# EAGLE design RFID_board_v211 (EAGLE 5.10)
DIGIKEY: Z1012-ND; MOUSER: 651-1935174
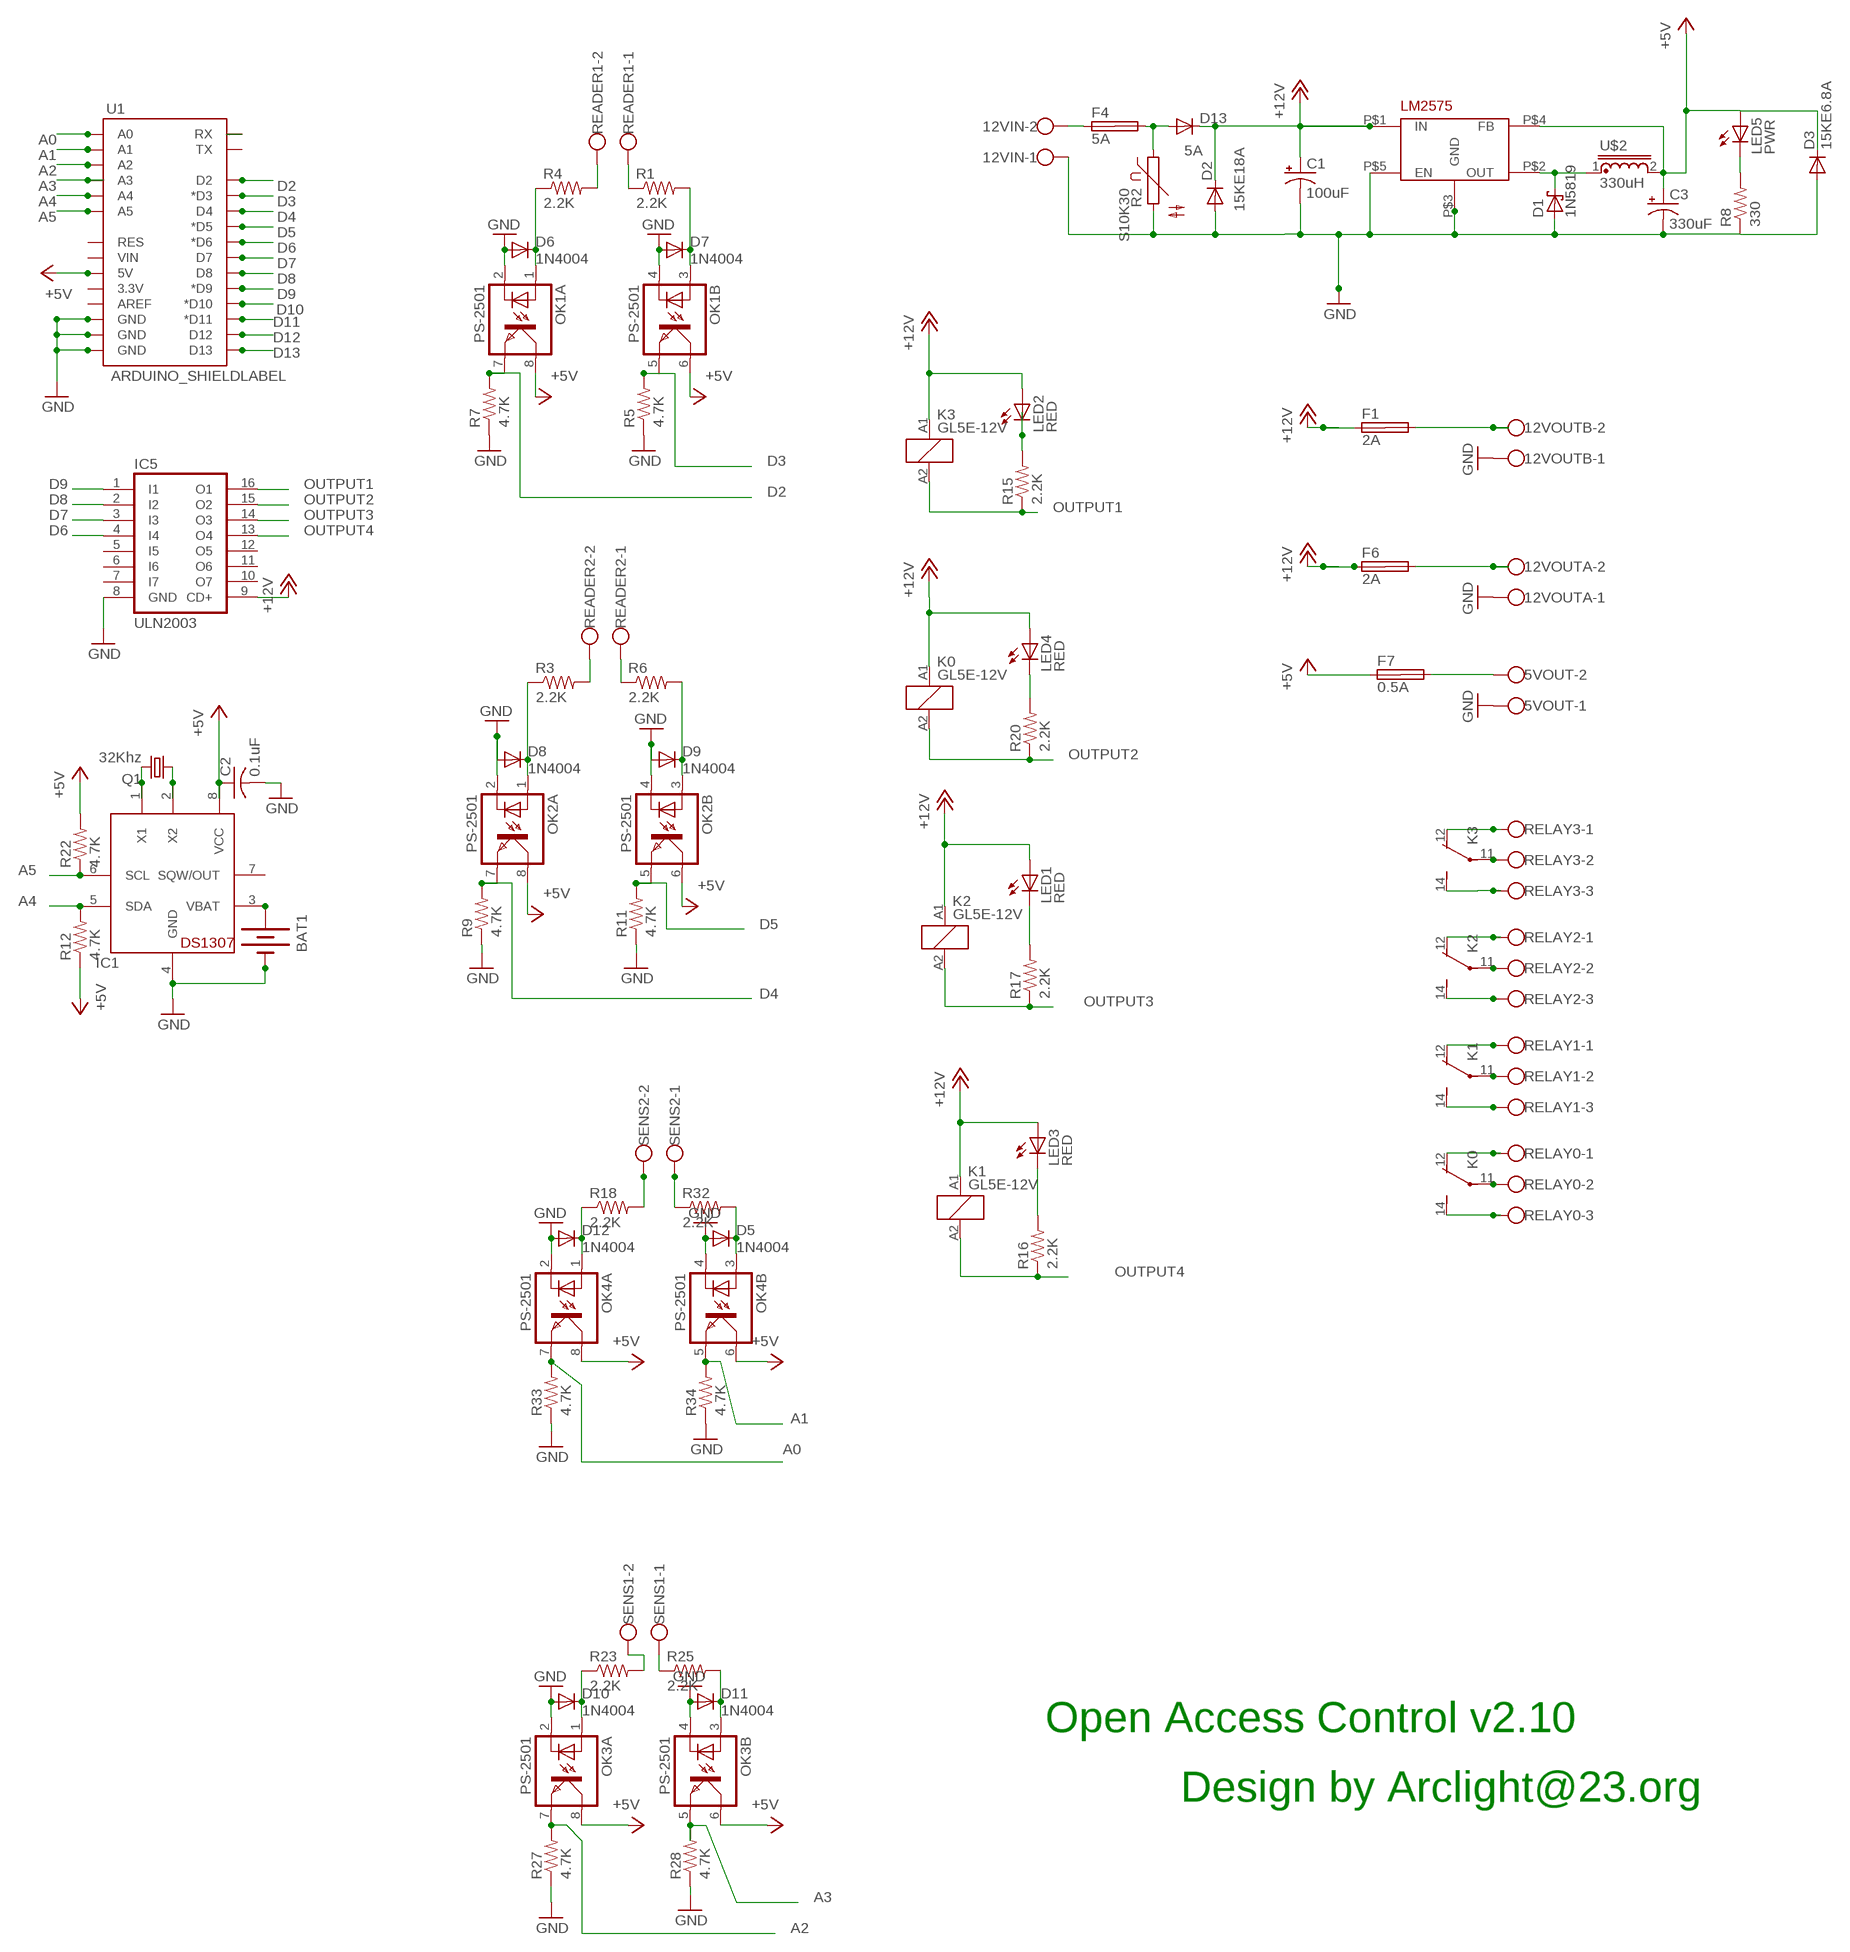
[diagram p0: schematic, sheet 1]

## Parts
5VOUT  W237-102  [W237-102]
12VIN  W237-102  [W237-102]
12VOUTA  W237-102  [W237-102]
12VOUTB  W237-102  [W237-102]
BAT1  BATTERY20PTH  [BATTCOM_20MM_PTH]
C1  100uF  CPOL-USE3.5-8  [E3,5-8]
C2  0.1uF  C-US050-025X075  [C050-025X075]
C3  330uF  CPOL-USE3.5-8  [E3,5-8]
D1  1N5819  1N5819-B  [DO41-7.6]
D2  15KE18A  [DO201-15]
D3  15KE6.8A  15KE18A  [DO201-15]
D5  1N4004  [DO41-10]
D6  1N4004  [DO41-10]
D7  1N4004  [DO41-10]
D8  1N4004  [DO41-10]
D9  1N4004  [DO41-10]
D10  1N4004  [DO41-10]
D11  1N4004  [DO41-10]
D12  1N4004  [DO41-10]
D13  5A  DIODE-P6-15  [P6-15]
F1  2A  5X20MMCLIP  [SHK20Q]
F4  5A  5X20MMCLIP  [SHK20Q]
F6  2A  5X20MMCLIP  [SHK20Q]
F7  0.5A  5X20MMCLIP  [SHK20Q]
IC1  DS1307  [DIL08]
IC5  ULN2003  ULN2003AN  [DIL16]
K0  GL5E-12V  ZNS5106  [ZN5]
K1  GL5E-12V  ZNS5106  [ZN5]
K2  GL5E-12V  ZNS5106  [ZN5]
K3  GL5E-12V  ZNS5106  [ZN5]
LED1  RED  LED5MM  [LED5MM]
LED2  RED  LED5MM  [LED5MM]
LED3  RED  LED5MM  [LED5MM]
LED4  RED  LED5MM  [LED5MM]
LED5  PWR  LED5MM  [LED5MM]
OK1  PS-2501  PS2501  [DIL08]
OK2  PS-2501  PS2501  [DIL08]
OK3  PS-2501  PS2501  [DIL08]
OK4  PS-2501  PS2501  [DIL08]
Q1  32Khz  CRYSTALTC26H  [TC26H]
R1  2.2K  R-US_0207/10  [0207/10]
R2  S10K30  [S10K]
R3  2.2K  R-US_0207/10  [0207/10]
R4  2.2K  R-US_0207/10  [0207/10]
R5  4.7K  R-US_0207/10  [0207/10]
R6  2.2K  R-US_0207/10  [0207/10]
R7  4.7K  R-US_0207/10  [0207/10]
R8  330  R-US_0207/10  [0207/10]
R9  4.7K  R-US_0207/10  [0207/10]
R11  4.7K  R-US_0207/10  [0207/10]
R12  4.7K  R-US_0207/10  [0207/10]
R15  2.2K  R-US_0207/10  [0207/10]
R16  2.2K  R-US_0207/10  [0207/10]
R17  2.2K  R-US_0207/10  [0207/10]
R18  2.2K  R-US_0207/10  [0207/10]
R20  2.2K  R-US_0207/10  [0207/10]
R22  4.7K  R-US_0207/10  [0207/10]
R23  2.2K  R-US_0207/10  [0207/10]
R25  2.2K  R-US_0207/10  [0207/10]
R27  4.7K  R-US_0207/10  [0207/10]
R28  4.7K  R-US_0207/10  [0207/10]
R32  2.2K  R-US_0207/10  [0207/10]
R33  4.7K  R-US_0207/10  [0207/10]
R34  4.7K  R-US_0207/10  [0207/10]
READER1  W237-102  [W237-102]
READER2  W237-102  [W237-102]
RELAY0  W237-103  [W237-103]
RELAY1  W237-103  [W237-103]
RELAY2  W237-103  [W237-103]
RELAY3  W237-103  [W237-103]
SENS1  W237-102  [W237-102]
SENS2  W237-102  [W237-102]
U1  ARDUINO_SHIELDLABEL  [DUEMILANOVE_SHIELD]
U$1  LM2575  [TO220-5PIN-1]
U$2  330uH  PE-52647NLPE-52647NL  [PE-52647-NL]

## Nets
+5V [signal]: C2.1 C3.+ D3.C F7.1A IC1.8(VCC) LED5.A OK1.6(B:COL) OK1.8(A:COL) OK2.6(B:COL) OK2.8(A:COL) OK3.6(B:COL) OK3.8(A:COL) OK4.6(B:COL) OK4.8(A:COL) R12.1 R22.2 U1.5V U$1.P$4(FB) U$2.2
+12V [signal]: C1.+ D2.C D13.C F1.1A F6.1A IC5.9(CD+) K0.A1 K1.A1 K2.A1 K3.A1 LED1.A LED2.A LED3.A LED4.A U$1.P$1(IN)
A0 [signal]: OK4.7(A:EMIT) R33.2 U1.A0
A1 [signal]: OK4.5(B:EMIT) R34.2 U1.A1
A2 [signal]: OK3.7(A:EMIT) R27.2 U1.A2
A3 [signal]: OK3.5(B:EMIT) R28.2 U1.A3
A4 [signal]: IC1.5(SDA) R12.2 U1.A4
A5 [signal]: IC1.6(SCL) R22.1 U1.A5
D1 [signal]: U1.RX
D2 [signal]: OK1.7(A:EMIT) R7.2 U1.D2
D3 [signal]: OK1.5(B:EMIT) R5.2 U1.D3(*D3)
D4 [power]: OK2.7(A:EMIT) R9.2 U1.D4
D5 [signal]: OK2.5(B:EMIT) R11.2 U1.D5(*D5)
D6 [signal]: IC5.4(I4) U1.D6(*D6)
D7 [signal]: IC5.3(I3) U1.D7
D8 [signal]: IC5.2(I2) U1.D8
D9 [signal]: IC5.1(I1) U1.D9(*D9)
D10 [signal]: U1.D10(*D10)
D11: U1.D11(*D11)
D12 [signal]: U1.D12
D13 [signal]: U1.D13
F3 [power]: 5VOUT.2 F7.2A
GND [ground]: 5VOUT.1 12VIN.1 12VOUTA.1 12VOUTB.1 BAT1.2(-) C1.- C2.2 C3.- D1.A D2.A D3.A D5.A D6.A D7.A D8.A D9.A D10.A D11.A D12.A IC1.4(GND) IC5.8(GND) OK1.2(A:C) OK1.4(B:C) OK2.2(A:C) OK2.4(B:C) OK3.2(A:C) OK3.4(B:C) OK4.2(A:C) OK4.4(B:C) R2.2 R5.1 R7.1 R8.1 R9.1 R11.1 R27.1 R28.1 R33.1 R34.1 U1.GND@0(GND) U1.GND@1(GND) U1.GND@2(GND) U$1.P$3(GND) U$1.P$5(EN)
N12V07: 12VOUTA.2 F6.2A
N12V99: 12VOUTB.2 F1.2A
N$1 [signal]: D6.C OK1.1(A:A) R4.1
N$2 [signal]: R18.2 SENS2.2
N$3 [signal]: R25.1 SENS1.1
N$4: K1.11(2:P) RELAY1.2
N$5 [signal]: D7.C OK1.3(B:A) R1.2
N$6 [signal]: D8.C OK2.1(A:A) R3.1
N$7: 12VIN.2 F4.1A
N$8 [signal]: D9.C OK2.3(B:A) R6.2
N$9: D13.A F4.2A R2.1
N$10 [power]: D1.C U$1.P$2(OUT) U$2.1
N$11 [signal]: R32.1 SENS2.1
N$12 [signal]: R6.1 READER2.1
N$13 [signal]: LED2.K(C) R15.2
N$14 [signal]: LED5.K(C) R8.2
N$15 [signal]: K2.14(2:S) RELAY2.3
N$16 [signal]: R3.2 READER2.2
N$17 [signal]: IC1.2(X2) Q1.1
N$18 [signal]: IC1.1(X1) Q1.2
N$19 [signal]: BAT1.1(+) IC1.3(VBAT)
N$20 [signal]: D10.C OK3.1(A:A) R23.1
N$21 [signal]: K3.12(2:O) RELAY3.1
N$22 [signal]: K3.14(2:S) RELAY3.3
N$23 [signal]: K1.12(2:O) RELAY1.1
N$24 [signal]: K1.14(2:S) RELAY1.3
N$25 [signal]: K0.12(2:O) RELAY0.1
N$26 [signal]: K0.14(2:S) RELAY0.3
N$27 [signal]: K2.12(2:O) RELAY2.1
N$28 [signal]: LED1.K(C) R17.2
N$29 [signal]: R1.1 READER1.1
N$30 [signal]: LED3.K(C) R16.2
N$33: K3.11(2:P) RELAY3.2
N$35 [signal]: LED4.K(C) R20.2
N$42 [signal]: D11.C OK3.3(B:A) R25.2
N$44 [signal]: D12.C OK4.1(A:A) R18.1
N$45: K2.11(2:P) RELAY2.2
N$47 [signal]: D5.C OK4.3(B:A) R32.2
N$51 [signal]: R4.2 READER1.2
N$55 [signal]: R23.2 SENS1.2
N$57: K0.11(2:P) RELAY0.2
OUTPUT1 [signal]: IC5.16(O1) K3.A2 R15.1
OUTPUT2 [signal]: IC5.15(O2) K0.A2 R20.1
OUTPUT3 [power]: IC5.14(O3) K2.A2 R17.1
OUTPUT4 [signal]: IC5.13(O4) K1.A2 R16.1
Unconnected: F1.1B F1.2B F4.1B F4.2B F6.1B F6.2B F7.1B F7.2B IC1.7(SQW/OUT) IC5.5(I5) IC5.6(I6) IC5.7(I7) IC5.10(O7) IC5.11(O6) IC5.12(O5) U1.3.3V U1.AREF U1.RES U1.TX U1.VIN

## Notes on the sheet
- Open Access Control v2.10
- Design by Arclight@23.org

## Library data of the parts
5VOUT 12VIN 12VOUTA 12VOUTB READER1 READER2 SENS1 SENS2 = 23B_Shop_Library:W237-102: WAGO SCREW CLAMP
BAT1 = SparkFun:BATTERY: Battery Holders Various common sizes : AA, AAA, 20mm coin cell and 12mm coin cell.
C1 C3 = adafruit:CPOL-US: POLARIZED CAPACITOR, American symbol
C2 = adafruit:C-US: CAPACITOR, American symbol
D1 = diode:1N581*: 1.0A SCHOTTKY BARRIER RECTIFIER Source: http://www.diodes.com/datasheets/ds23001.pdf
D2 D3 = 23B_Shop_Library:15KE18A: TVS Diode 15V TVS Protection Diode
D5-D12 = diode:1N4004: DIODE general purpose rectifier, 1 A
D13 = diode:DIODE-: DIODE
F1 F4 F6 F7 = 23B_Shop_Library:5X20MMCLIP: FUSE HOLDER Littelfuse 01110506H 5x20mm clips. Mouser part #576-01110506H
IC1 = 23B_Shop_Library:DS1307: DS1307 Real time clock (RTC) with battery backup ability. Talk to it via i2c
IC5 = 23B_Shop_Library:ULN2003A: DRIVER ARRAY
K0 K1-K3 = relay:ZNS5*: Miniature Power PCB Relay SCHRACK 1pole 10 A Source: http://www.schrack.com/.. 5847.pdf
LED1-LED5 = adafruit:LED: LED OSRAM: - CHIPLED LG R971, LG N971, LY N971, LG Q971, LY Q971, LO R971, LY R971 LH N974, LH R974 LS Q976, LO Q976, LY Q976 LO Q996 - Hyper CHIPLED LW Q18S LB Q993, LB Q99A, LB R99A - SideLED LS A670, LO A670, LY A670, LG A670, LP A670 LB A673, LV A673, LT A673, LW A673 LH A674 LY A675 LS A676, LA A676, LO A676, LY A676, LW A676 LS A679, LY A679, LG A679 - Hyper Micro SIDELED® LS Y876, LA Y876, LO Y876, LY Y876 LT Y87S - SmartLED LW L88C, LW L88S LB L89C, LB L89S, LG L890 LS L89K, LO L89K, LY L89K LS L896, LA L896, LO L896, LY L896 - TOPLED LS T670, LO T670, LY T670, LG T670, LP T670 LSG T670, LSP T670, LSY T670, LOP T670, LYG T670 LG T671, LOG T671, LSG T671 LB T673, LV T673, LT T673, LW T673 LH T674 LS T676, LA T676, LO T676, LY T676, LB T676, LH T676, LSB T676, LW T676 LB T67C, LV T67C, LT T67C, LS T67K, LO T67K, LY T67K, LW E67C LS E67B, LA E67B, LO E67B, LY E67B, LB E67C, LV E67C, LT E67C LW T67C LS T679, LY T679, LG T679 LS T770, LO T770, LY T770, LG T770, LP T770 LB T773, LV T773, LT T773, LW T773 LH T774 LS E675, LA E675, LY E675, LS T675 LS T776, LA T776, LO T776, LY T776, LB T776 LHGB T686 LT T68C, LB T68C - Hyper Mini TOPLED® LB M676 - Mini TOPLED Santana® LG M470 LS M47K, LO M47K, LY M47K Source: http://www.osram.convergy.de/
OK1-OK4 = 23B_Shop_Library:PS2501: NEC PS OPTO COUPLER
Q1 = crystal:CRYSTAL: CRYSTAL
R1 R3-R9 R11 R12 R15-R18 R20 R22 R23 R25 R27 R28 R32-R34 = resistor:R-US_: RESISTOR, American symbol
R2 = 23B_Shop_Library:S10K30: VARISTOR - 30V, 10mm package
RELAY0 RELAY1-RELAY3 = 23B_Shop_Library:W237-103: WAGO SCREW CLAMP
U1 = SparkFun:ARDUINO_SHIELD
U$1 = 23B_Shop_Library:LM2575: Fixed 5V Simple Switcher from National, staggered pins
U$2 = 23B_Shop_Library:PE-52647NL: 330uH, 1A Inductor from Pulse Engineering. Used with National Semiconductor Simple Switcher.

## Net classes
0 5APower: width 2.921 mm, clearance 0.406 mm
1 power: width 0.61 mm, clearance 0.406 mm
2 signal: width 0.406 mm, clearance 0.305 mm
3 ground: width 0.406 mm, drill 0.127 mm, clearance 0.254 mm to class 0, clearance 0.254 mm to class 1, clearance 0.254 mm to class 2

## Board
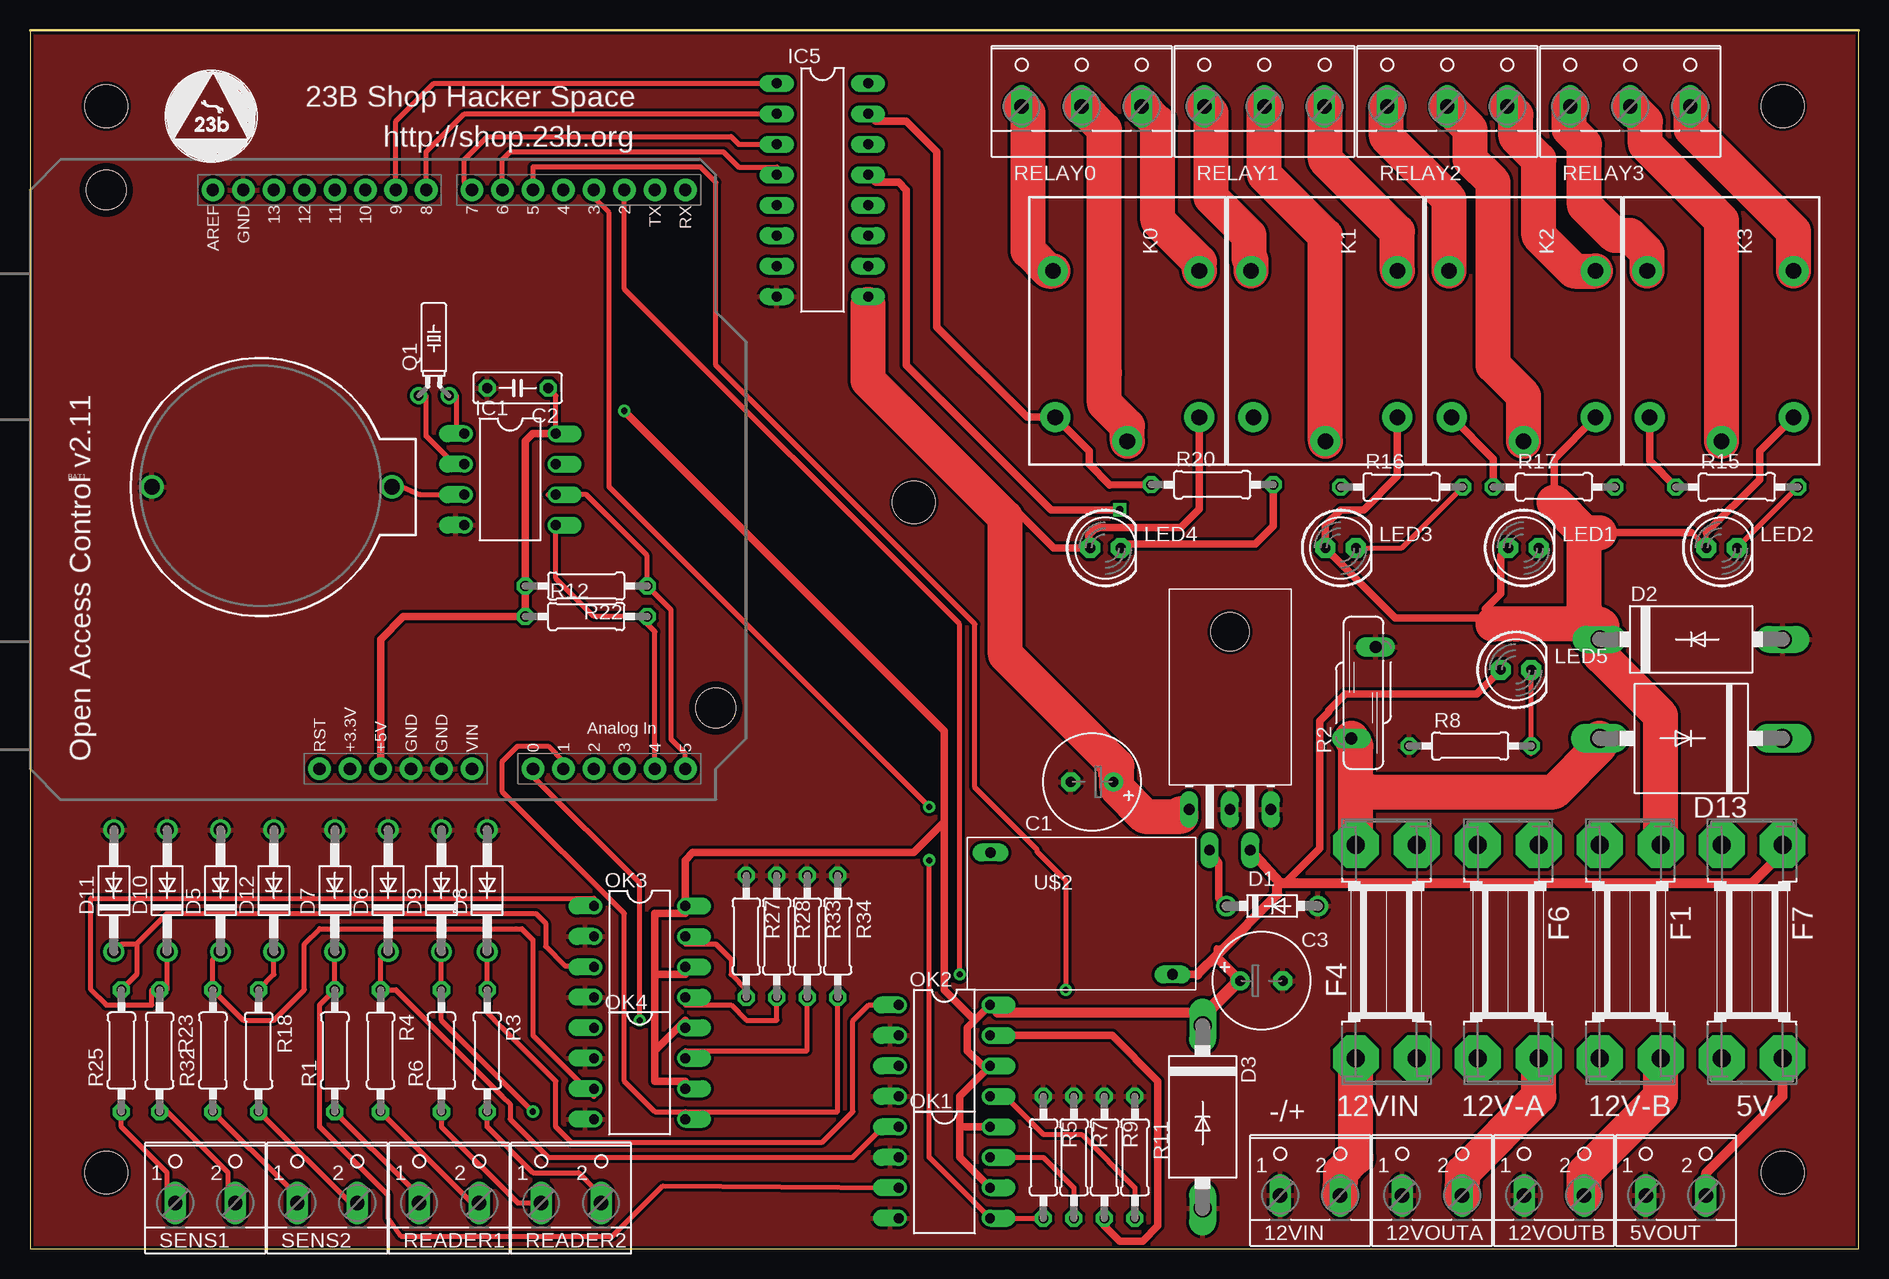
[diagram p1: board, top side]
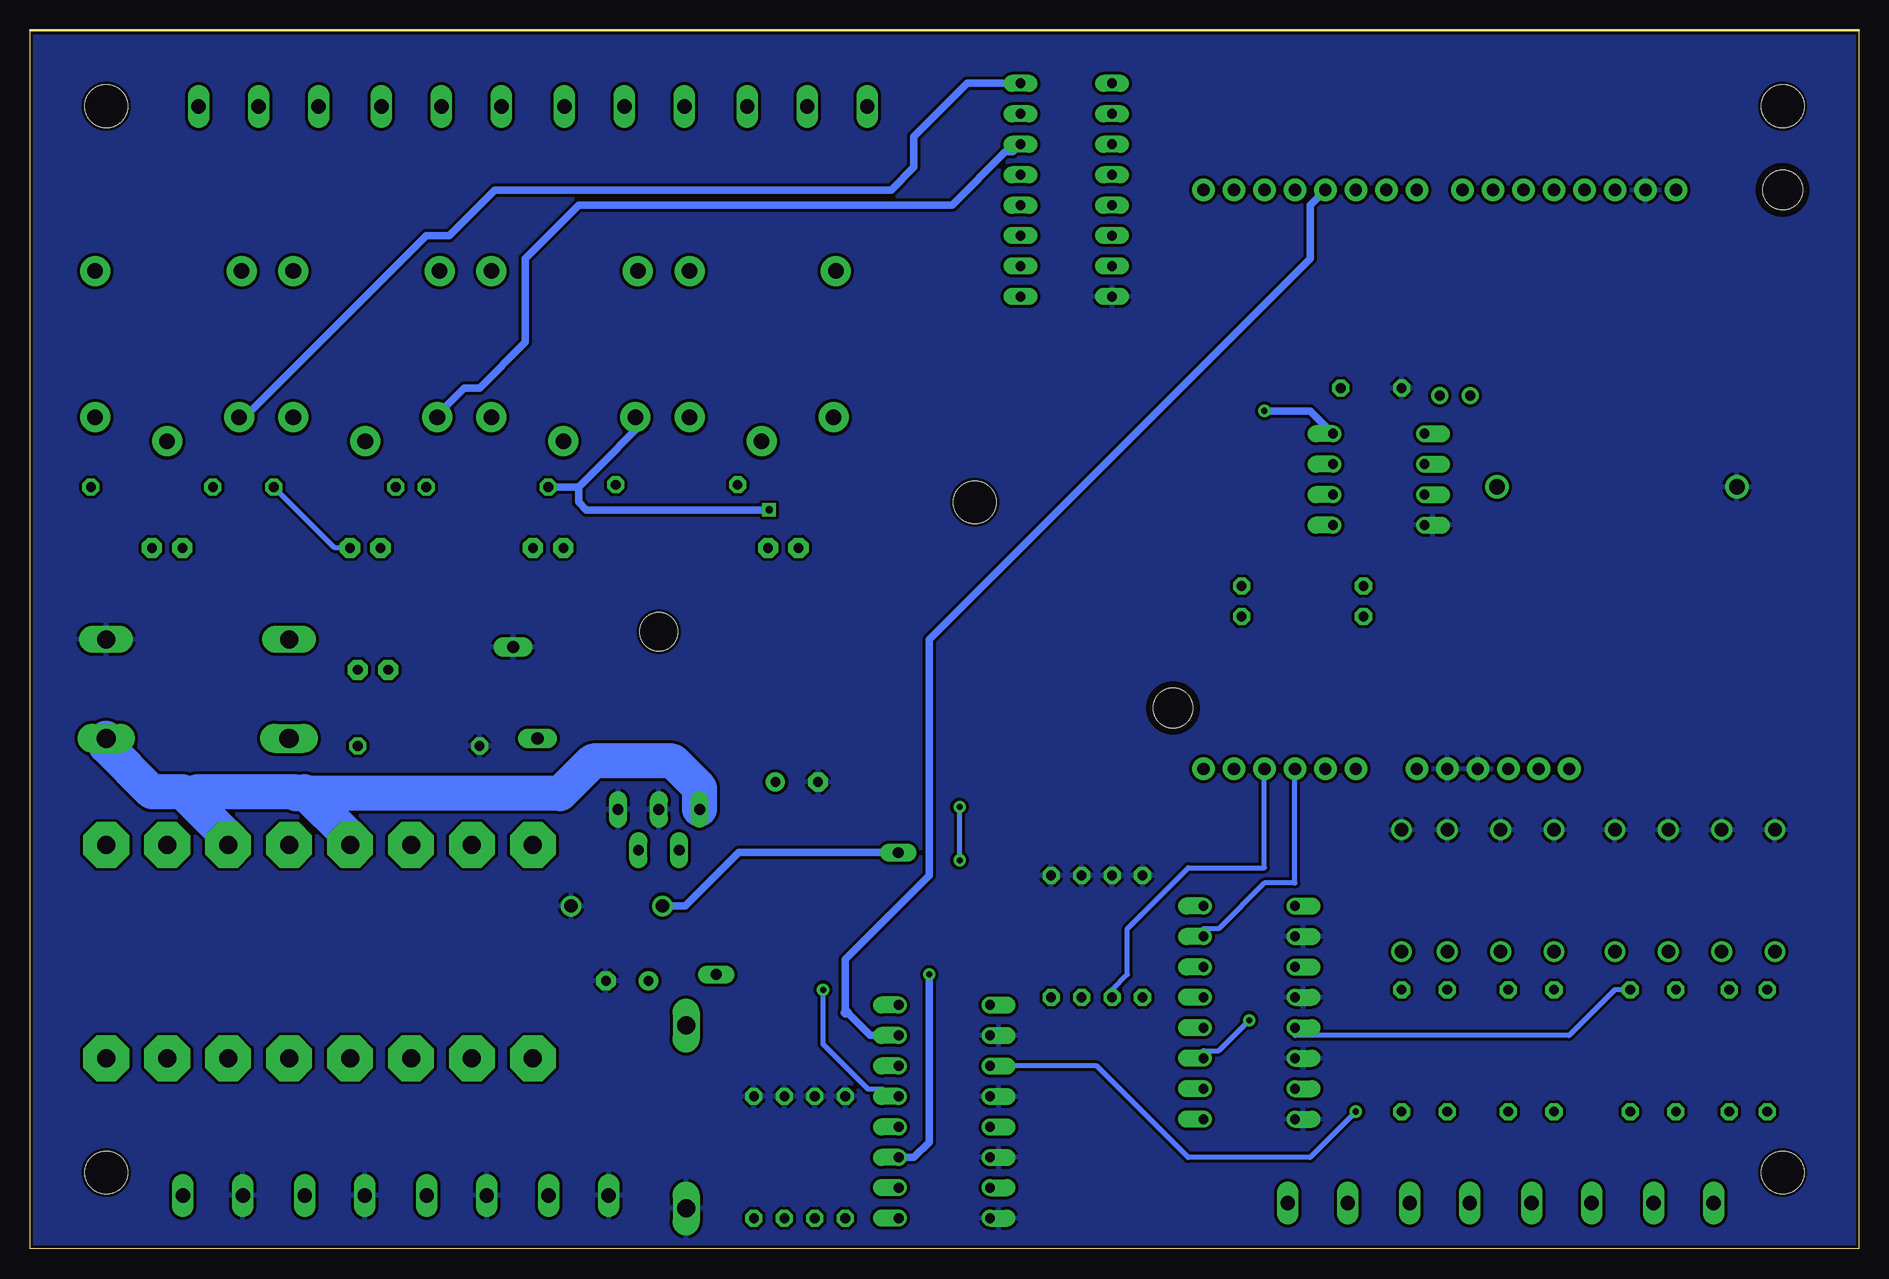
[diagram p2: board, bottom side, seen from below]

Size 152.4 x 101.6 mm. Coordinates in mm from the lower left corner, seen from the top.
Outline: 0,0 152.4,0 152.4,101.6 0,101.6 0,0
Copper layers (1*16): Top 0.035mm / dielectric 1.5mm / Bottom 0.035mm
Design rules "SparkFun": minimum track width 8mil, minimum drill 20mil, track to track 8mil, track to pad 8mil, pad to pad 8mil, via to via 8mil, smd to smd 8mil, copper to edge 10mil, drill to drill 8mil, minimum pad ring 12mil, minimum via ring 10mil, stop-mask expansion 4mil, vias tented up to drill 25mil, thermal gap 10mil
Holes 3.56 mm at 6.35,6.35 6.35,95.25 146.05,95.25 146.05,6.35 73.66,62.23

### Footprints (pad centres in the part's own frame; a part is rotated, then mirrored left to right if it is on the bottom)
W237-102 = drill 1.194 long: 1 -2.5,-1.27; 2 2.5,-1.27
BATTCOM_20MM_PTH = drill 1.3 round: 1 20,0; 2 0,0
E3,5-8 = drill 0.813 pad 1.6 round: + -1.778,0 | drill 0.813 pad 1.6 octagon: - 1.778,0
C050-025X075 = drill 0.813 octagon: 1 -2.54,0; 2 2.54,0
DO41-7.6 = drill 1.1 pad 1.7 round: A 3.81,0; C -3.81,0
DO201-15 = drill 1.499 long: A 7.62,0; C -7.62,0
DO41-10 = drill 1.118 round: A 5.08,0; C -5.08,0
P6-15 = drill 1.6 long: A 7.62,0; C -7.62,0
SHK20Q = drill 1.5 pad 3.81 octagon: 1A -8.89,2.54; 1B -8.89,-2.54; 2A 8.89,2.54; 2B 8.89,-2.54
DIL08 = drill 0.813 offset: 1 -3.81,-3.81; 2 -1.27,-3.81; 3 1.27,-3.81; 4 3.81,-3.81; 5 3.81,3.81; 6 1.27,3.81; 7 -1.27,3.81; 8 -3.81,3.81
DIL16 = drill 0.813 long: 1 -8.89,-3.81; 2 -6.35,-3.81; 3 -3.81,-3.81; 4 -1.27,-3.81; 5 1.27,-3.81; 6 3.81,-3.81; 7 6.35,-3.81; 8 8.89,-3.81; 9 8.89,3.81; 10 6.35,3.81; 11 3.81,3.81; 12 1.27,3.81; 13 -1.27,3.81; 14 -3.81,3.81; 15 -6.35,3.81; 16 -8.89,3.81
ZN5 = drill 1.3 pad 2.5 round: 11 8.89,0; 12 -5.31,-6.2; 14 -5.31,6; A1 6.89,6; A2 6.89,-6
LED5MM = drill 0.813 pad 1.676 octagon: A -1.27,0; K 1.27,0
TC26H = drill 0.813 round: 1 -1.27,0; 2 1.27,0
0207/10 = drill 0.813 octagon: 1 -5.08,0; 2 5.08,0
S10K = drill 1.016 long: 1 -1.016,-3.81; 2 1.016,3.81
W237-103 = drill 1.194 long: 1 -5,-1.29; 2 0,-1.29; 3 5,-1.29
DUEMILANOVE_SHIELD = drill 1.016 pad 1.88 round: 3.3V 50.8,26.67; 5V 50.8,29.21; A0 50.8,41.91; A1 50.8,44.45; A2 50.8,46.99; A3 50.8,49.53; A4 50.8,52.07; A5 50.8,54.61; AREF 2.54,15.24; D2 2.54,49.53; D3 2.54,46.99; D4 2.54,44.45; D5 2.54,41.91; D6 2.54,39.37; D7 2.54,36.83; D8 2.54,33.02; D9 2.54,30.48; D10 2.54,27.94; D11 2.54,25.4; D12 2.54,22.86; D13 2.54,20.32; GND@0 50.8,31.75; GND@1 50.8,34.29; GND@2 2.54,17.78; RES 50.8,24.13; RX 2.54,54.61; TX 2.54,52.07; VIN 50.8,36.83 | hole 3.302: 45.72,57.15; 2.54,6.35
TO220-5PIN-1 = drill 0.9 long: P$1 -3.4,1.7; P$2 -1.7,-1.7; P$3 0,1.7; P$4 1.7,-1.7; P$5 3.4,1.7 | hole 3.175: 0,16.51
PE-52647-NL = drill 0.9 long: 1 -7.58,6.35; 2 7.58,-3.81

### Placement (x,y rotation side)
5VOUT  137.16,5.71 0 top
12VIN  106.68,5.71 0 top
12VOUTA  116.84,5.71 0 top
12VOUTB  127,5.71 0 top
BAT1  10.16,63.5 0 top
C1  88.51,38.91 180 top
C2  40.64,71.75 180 top
C3  102.63,22.34 0 top
D1  103.5,28.57 0 top
D2  138.43,50.8 0 top
D3  97.71,10.99 270 top
D5  15.88,29.84 90 top
D6  29.84,29.84 90 top
D7  25.4,29.84 90 top
D8  38.1,29.84 90 top
D9  34.29,29.84 90 top
D10  11.43,29.84 90 top
D11  6.99,29.84 90 top
D12  20.32,29.84 90 top
D13  138.43,42.55 180 top
F1  133.35,24.77 270 top
F4  113.03,24.77 90 top
F6  123.19,24.77 270 top
F7  143.51,24.77 270 top
IC1  40.01,64.14 270 top
IC5  66.04,88.27 270 top
K0  91.44,76.2 270 top
K1  107.95,76.2 270 top
K2  124.46,76.2 270 top
K3  140.97,76.2 270 top
LED1  124.46,58.42 0 top
LED2  140.97,58.42 0 top
LED3  109.22,58.42 0 top
LED4  89.62,58.42 0 top
LED5  123.83,48.26 0 top
OK1  76.2,6.35 270 top
OK2  76.2,16.51 270 top
OK3  50.8,24.77 270 top
OK4  50.8,14.61 270 top
Q1  33.66,71.12 0 top
R1  25.4,16.51 90 top
R2  111.12,46.35 0 top
R3  38.1,16.51 270 top
R4  29.21,16.51 270 top
R5  84.45,7.62 270 top
R6  34.29,16.51 90 top
R7  87,7.62 270 top
R8  120.02,41.91 0 top
R9  89.53,7.62 270 top
R11  92.08,7.62 270 top
R12  46.35,52.7 0 top
R15  142.24,63.5 0 top
R16  114.3,63.5 0 top
R17  127,63.5 0 top
R18  19.05,16.51 270 top
R20  98.51,63.69 0 top
R22  46.35,55.24 180 top
R23  10.79,16.51 270 top
R25  7.62,16.51 90 top
R27  59.69,26.04 270 top
R28  62.23,26.04 270 top
R32  15.24,16.51 90 top
R33  64.77,26.04 270 top
R34  67.31,26.04 270 top
READER1  34.92,5.08 0 top
READER2  45.09,5.08 0 top
RELAY0  87.63,96.52 0 top
RELAY1  102.87,96.52 0 top
RELAY2  118.11,96.52 0 top
RELAY3  133.35,96.52 0 top
SENS1  14.61,5.08 0 top
SENS2  24.77,5.08 0 top
U1  0,90.81 270 top
U$1  100,34.92 0 top
U$2  87.63,26.67 0 top

### Tracks (layer width: path | path; a pad name or v marks a point on that pad's centre or on a via)
+5V  (via drill 0.51)
  Top 0.406: IC1.8 43.81,71.12 C2.1 | 99.06,24.64 98.86,24.64 98.86,25.08 99.16,25.08
  Top 0.61: 52.07,16.51 52.07,13.97 54.61,13.97 OK4.6 | 52.07,16.51 54.61,19.05 OK4.8 | 52.07,22.86 54.61,22.86 OK3.6 | 52.07,16.51 52.07,22.86 | 52.07,22.86 52.07,27.94 54.61,27.94 OK3.8 54.61,29.21 54.61,31.11 54.61,32.38 55.24,33.02 73.66,33.02 76.2,35.56 | 103.94,30.28 104.14,30.48 U$1.P$4 | 146.05,33.02 F7.1A | U1.5V 29.21,50.8 31.11,52.7 R12.1 R22.2 41.27,67.31 41.91,67.94 IC1.8 | OK1.6 77.47,7.62 77.47,10.16 | 77.47,10.16 77.47,12.7 OK2.6 79.38,15.24 78.11,16.51 78.11,18.41 78.74,19.05 | 77.47,10.16 OK1.8 | 78.74,19.05 OK2.8 | 78.74,19.05 76.2,21.59 76.2,35.56 | v49.53,69.85 76.2,43.18 76.2,35.56 | 99.06,24.13 99.06,24.64 | 97.28,22.86 U$2.2 | 97.79,19.68 100.33,22.23 100.33,22.86 | LED5.A 120.55,46.25 109.59,46.25 108.22,44.88 108.22,44.73 107.47,43.98 107.47,33.35 104.6,30.48
  Top 0.813: 146.05,33.02 143.51,30.48 104.6,30.48 104.14,30.48 U$1.P$4 | OK2.8 80.64,19.68 86.36,19.68 97.79,19.68 | 99.06,24.13 100.33,22.86 C3.+ 97.71,19.2 D3.C | 97.28,22.86 99.06,24.64 103.94,29.52 103.94,30.28
  Bottom 0.61: v49.53,69.85 45.72,69.85 44.45,68.58 IC1.8
+12V
  Top 0.406: 138.43,59.69 LED2.A | 130.81,59.69 130.18,59.69 130.18,58.42 128.91,59.69 | LED2.A 139.7,57.78 | LED2.A 139.7,59.05 | 139.7,59.05 139.7,59.69 | 127,64.77 127,62.87 | LED2.A 139.7,59.05 | 121.28,51.44 121.28,52.59 121.28,53.34 | 90.56,38.39 91.48,38.39 91.48,37.92 92.69,37.92 92.69,37.01 91.17,37.01 91.17,38.52 91.33,38.52 91.33,39.42 89.22,39.42 89.22,41.24 88.8,41.24 88.8,40.93
  Top 0.61: 130.81,59.69 138.43,59.69 | LED1.A 122.56,57.78 122.56,54.61 121.28,53.34 | K3.A1 144.15,66.48 144.15,64.14 139.7,59.69 | K2.A1 127,65.85 127,64.77 127,62.23 | K1.A1 113.95,64.42 111.12,61.59 109.22,61.59 107.95,60.33 LED3.A 113.78,52.59 120.75,52.59 | 82.94,60.8 85.32,58.42 LED4.A 88.24,58.53 88.24,59.51 88.77,60.05 88.92,60.05 89,60.12 95.9,60.12 97.44,61.66 K0.A1 | 82.94,60.8 81.95,61.78 | 81.28,60.96 82.78,60.96 82.94,60.8 | 121.92,52.07 121.92,52.26 | 121.92,52.26 122.25,52.59 | 120.75,52.59 121.28,52.59 | 121.92,52.26 121.08,52.26 120.75,52.59
  Top 0.813: 69.85,78.74 IC5.9 | C1.+ 88.8,40.93 87.9,42.15 | 95.91,36.26 96.6,37.47 U$1.P$1
  Top 2.921: 69.85,78.74 69.85,72.39 81.28,60.96 81.28,49.53 86.97,43.84 87.95,42.86 90.56,40.25 90.56,38.39 92.91,36.04 95.91,36.04 95.91,36.26 | 129.54,52.07 130.81,52.07 131,51.88 131,51.28 | 123.83,52.07 121.92,52.07 | 129.54,52.07 123.83,52.07 | F1.1A 135.89,34.29 135.89,44.45 130.81,49.53 130.81,49.51 131,49.31 131,51.28 | 129.54,59.69 127,62.23 | 129.54,59.69 129.54,53.34 129.54,52.07 | 129.54,59.69 130.81,59.69 | 123.83,52.07 123.19,52.07 | D2.C 130.81,51.09 131,51.28
  Bottom 2.921: 139.06,37.47 135.89,34.29 F1.1A | 139.06,37.47 139.7,38.1 142.24,38.1 146.05,41.91 D13.C | 130.4,38.1 129.54,38.1 125.73,34.29 F6.1A | 130.4,38.1 138.43,38.1 139.06,37.47 | U$1.P$1 96.6,38.4 98.86,40.65 105.5,40.65 108.22,37.94 130.24,37.94 130.4,38.1
A0  (via drill 0.51)
  Top 0.406: OK4.7 54.61,16.51 64.77,16.51 64.77,20.32 R33.2 | v50.8,19.05 50.8,30.48 41.91,39.37 U1.A0
  Bottom 0.406: v50.8,19.05 53.34,16.51 54.61,16.51 OK4.7
A1
  Top 0.406: 54.61,11.43 67.31,11.43 67.31,19.05 R34.2 | 54.61,11.43 OK4.5 54.61,11.43 | 54.61,11.43 52.07,11.43 49.53,13.97 49.53,27.94 39.37,38.1 39.37,40.64 40.64,41.91 43.18,41.91 44.45,40.64 U1.A1
A2
  Top 0.406: R27.2 59.69,21.59 58.42,22.86 58.42,24.13 57.15,25.4 54.61,25.4 OK3.7
  Bottom 0.406: U1.A2 46.99,39.37 46.99,30.48 49.53,30.48 53.34,26.67 54.61,26.67 OK3.7
A3
  Top 0.406: OK3.5 54.61,20.32 58.42,20.32 59.69,19.05 62.23,19.05 62.23,20.32 R28.2
  Bottom 0.406: U1.A3 49.53,39.37 49.53,31.75 55.88,31.75 60.96,26.67 60.96,22.86 62.23,21.59 R28.2
A4
  Top 0.406: U1.A4 52.07,39.37 | U1.A4 52.07,40.64 | IC1.5 43.81,55.88 46.99,52.7 R12.2 51.44,52.07 52.07,51.44 U1.A4
A5
  Top 0.406: 43.18,62.87 IC1.6 46.35,62.87 51.44,57.78 R22.1 53.43,53.25 53.43,53.2 53.43,42.47 54.61,41.29 U1.A5
D2  (via drill 0.51)
  Top 0.406: v77.47,22.86 77.47,52.07 49.53,80.01 49.53,87.63 U1.D2 | OK1.7 84.45,7.62 87,5.08 R7.2
  Bottom 0.61: OK1.7 78.74,7.62 77.47,8.89 v77.47,22.86
D3  (via drill 0.51)
  Top 0.406: v74.93,32.38 74.93,7.62 OK1.5 81.28,2.54 | v74.93,36.83 48.26,63.5 48.26,86.36 46.99,87.63 U1.D3 | 81.28,2.54 80.64,2.54 | 81.28,2.54 R5.2
  Bottom 0.406: v74.93,32.38 v74.93,36.83
D4
  Top 0.61: R9.2 89.53,1.91 90.81,0.64 92.71,0.64 93.98,1.91 93.98,13.97 90.17,17.78 OK2.7
  Bottom 0.61: U1.D4 45.72,87 45.72,82.55 77.47,50.8 77.47,47.62 77.47,31.11 78.74,29.84 84.45,24.13 84.45,19.68 | 84.3,19.68 82.4,17.78 OK2.7
  Bottom 0.813: 84.3,19.68 84.45,19.68
D5  (via drill 0.51)
  Top 0.406: U1.D5 41.91,88.9 41.91,90.17 55.88,90.17 57.15,88.9 57.15,73.66 78.74,52.07 78.74,38.44 80.3,36.88 80.3,36.87 83.92,33.25 83.92,33.1 86.33,30.68 86.33,21.77 | R11.2 92.08,5.08 87.63,9.53 84.45,9.53 82.55,11.43 81.28,12.7 80.64,12.7 OK2.5 | 86.33,21.77 86.64,21.46 | v86.31,21.59 86.33,21.59 86.33,21.77
  Bottom 0.406: v86.31,21.59 86.31,17.04 82.56,13.3 81.34,13.3 80.75,12.7 OK2.5
D6
  Top 0.406: U1.D6 39.37,90.81 40.01,91.44 57.78,91.44 59.05,90.17 62.23,90.17 IC5.4
D7
  Top 0.406: U1.D7 36.2,88.9 36.2,90.81 38.1,92.71 58.42,92.71 59.05,92.08 IC5.3
D8
  Top 0.406: IC5.2 36.2,94.61 33.02,91.44 U1.D8
D9
  Top 0.406: IC5.1 33.66,97.16 30.48,93.98 U1.D9
F3
  Top 0.61: 146.05,15.24 F7.2A
  Top 0.813: 146.05,15.24 146.05,12.7 139.7,6.35 5VOUT.2
GND
  pour Bottom (isolate 0.254): 0,0 0,101.6 152.4,101.6 152.4,0
  pour Top (isolate 0.254): 0.03,99.52 0.03,0.04 152.29,0.04 152.29,101.6 -0.29,101.6
N12V07
  Top 2.921: 12VOUTA.2 119.38,6.35 125.73,12.7 125.73,15.24 F6.2A
N12V99
  Top 2.921: 12VOUTB.2 129.54,6.35 135.89,12.7 135.89,15.24 F1.2A
N$1
  Top 0.406: OK1.1 71.12,10.16 68.58,7.62 43.18,7.62 40.01,10.79 40.01,12.06 39.37,12.7 30.48,21.59 R4.1 29.21,24.13 D6.C
N$2
  Top 0.406: R18.2 26.67,3.81 SENS2.2
N$3
  Top 0.406: R25.1 7.62,10.16 11.43,6.35 11.43,3.81 SENS1.1
N$4
  Top 2.921: RELAY1.2 102.87,89.53 107.95,84.45 K1.11
N$5
  Top 0.406: D7.C 25.4,24.13 R1.2 24.13,20.32 24.13,10.16 29.21,5.08 29.84,4.45 29.84,2.54 30.9,1.04 48.54,1.04 50.02,2.54 52.74,5.23 OK1.3
N$6
  Top 0.406: D8.C 38.1,24.13 R3.1 38.1,20.95 | 38.1,20.95 38.1,20.32 | 38.1,20.95 38.1,19.68 39.37,18.41 43.81,13.97 43.81,10.16 45.09,8.89 66.04,8.89 68.58,11.43 68.58,18.99 69.91,20.32 OK2.1
N$7
  Top 2.921: 12VIN.2 109.22,6.35 110.49,7.62 110.49,15.24 F4.1A
N$8  (via drill 0.51)
  Top 0.406: D9.C 34.29,24.13 R6.2 34.29,20.32 34.29,19.05 v41.91,11.43
  Bottom 0.406: OK2.3 63.5,15.24 55.88,7.62 45.72,7.62 v41.91,11.43
N$9
  Top 2.921: 110.49,38.1 110.49,34.29 F4.2A | 110.49,38.1 110.49,41.91 R2.1 | D13.A 130.81,41.91 127,38.1 111.76,38.1 110.49,38.1
N$10
  Top 0.61: D1.C 99.59,28.66 99.06,29.21 99.06,32.16 U$1.P$2
  Bottom 0.61: U$2.1 93.34,33.02 97.79,28.57 D1.C
N$11
  Top 0.406: R32.1 21.59,5.08 21.59,3.81 SENS2.1
N$12
  Top 0.406: R6.1 34.29,10.16 40.64,3.81 41.91,3.81 READER2.1
N$13
  Top 0.406: LED2.K R15.2
N$14
  Top 0.406: R8.2 125.09,41.27 125.09,47.62 LED5.K
N$15
  Top 2.921: RELAY2.3 123.83,94.52 123.83,92.71 125.73,90.81 125.73,84.45 128.68,81.51 K2.14
N$16
  Top 0.406: R3.2 38.1,10.16 41.91,6.35 45.72,6.35 46.35,5.71 47.62,4.45 47.62,3.85 READER2.2 46.99,3.81
N$17
  Top 0.406: IC1.2 35.56,65.2 33.02,67.74 33.02,71.12 Q1.1
N$18
  Top 0.406: IC1.1 35.56,68.58 35.56,71.12 Q1.2
N$19
  Top 0.406: IC1.3 32.49,62.89 31.05,63.5 BAT1.1
N$20
  Top 0.406: D10.C 11.43,24.13 11.43,21.59 R23.1 10.16,21.59 10.16,20.32 6.35,20.32 5.08,21.59 5.08,29.21 46.99,29.21 OK3.1
N$21
  Top 2.921: RELAY3.1 128.27,95.15 128.27,93.34 129.54,92.08 129.54,87 132.08,84.45 133.35,84.45 134.77,83.03 K3.12
N$22
  Top 2.921: RELAY3.3 138.43,95.15 138.43,93.34 146.97,84.81 K3.14
N$23
  Top 2.921: RELAY1.1 98.42,94.67 98.42,87.63 101.6,84.45 101.6,82.55 101.75,82.4 K1.12
N$24
  Top 2.921: RELAY1.3 107.95,95.15 107.95,90.81 113.95,84.81 K1.14
N$25
  Top 2.921: RELAY0.1 83.19,94.67 83.19,83.19 84.86,81.51 K0.12
N$26
  Top 2.921: RELAY0.3 93.98,93.88 93.98,85.72 97.44,82.27 K0.14
N$27
  Top 2.921: RELAY2.1 113.03,95.15 113.03,92.71 118.26,87.48 K2.12
N$28
  Bottom 0.406: R17.2 127,58.42 LED1.K
N$29
  Top 0.406: R1.1 31.75,5.08 31.75,3.81 READER1.1
N$30
  Top 0.406: R16.2 114.3,58.42 LED3.K
N$33
  Top 2.921: RELAY3.2 134.6,93.98 134.62,93.98 134.62,92.08 140.97,85.72 K3.11
N$35
  Top 0.61: R20.2 103.59,60.24 102.11,58.75 91.22,58.75 LED4.K
N$42
  Top 0.406: R25.2 8.89,22.86 8.89,25.4 | 8.89,25.4 11.43,27.94 41.73,27.94 42.16,27.94 42.98,27.13 42.98,25.18 44.56,23.6 46.89,23.6 OK3.3 | D11.C 7.62,25.4 8.89,25.4
N$44
  Top 0.406: R18.1 20.32,22.86 20.32,24.13 D12.C
  Bottom 0.406: R18.1 20.32,21.59 24.13,17.78 46.99,17.78 OK4.1
N$45
  Top 2.921: RELAY2.2 120.02,93.33 120.02,90.81 121.92,88.9 121.92,73.66 124.46,71.12 K2.11
N$47
  Top 0.406: OK4.3 46.99,12.7 41.91,17.78 41.91,25.76 41,26.67 40.51,26.67 24.13,26.67 22.86,25.4 22.86,21.59 20.32,19.05 17.78,19.05 R32.2 15.24,24.13 D5.C
N$51
  Top 0.406: R4.2 36.83,3.81 READER1.2
N$55
  Top 0.406: R23.2 11.43,11.43 16.51,6.35 16.51,3.81 SENS1.2
N$57
  Top 2.921: RELAY0.2 89.53,93.33 89.53,73.03 89.53,70.48 91.44,68.58 K0.11
OUTPUT1
  Top 0.61: R15.1 134.97,65.69 K3.A2
  Bottom 0.406: 134.53,69.31 K3.A2
  Bottom 0.61: IC5.16 74.3,97.16 78.74,92.71 78.74,90.17 80.64,88.27 113.67,88.27 117.47,84.45 119.38,84.45 134.53,69.31
OUTPUT2
  Top 0.406: 70.48,93.98 IC5.15
  Top 0.61: 70.48,93.98 73.03,93.98 75.56,91.44 75.56,76.83 83.09,69.31 K0.A2 88.27,66.48 88.27,65.41 89.99,63.68 R20.1
OUTPUT3
  Top 0.61: K2.A2 121.92,65.85 R17.1
  Bottom 0.61: IC5.14 70.48,91.44 71.12,91.44 75.56,87 106.68,87 111.12,82.55 111.12,75.56 114.94,71.75 116.2,71.75 118.46,69.5 K2.A2
OUTPUT4  (via drill 0.6)
  Top 0.61: 73.03,85.72 73.03,73.66 85.09,61.59 v90.81,61.59 | 73.03,85.72 73.03,86.36 | IC5.13 70.48,88.9 72.39,88.9 73.03,88.27 73.03,85.72
  Bottom 0.61: v90.81,61.59 106.05,61.59 106.68,62.23 106.68,63.5 | K1.A2 101.95,68.23 104.78,65.41 106.68,63.5 | 106.68,63.5 R16.1

### Text on the board
Document: Dimensions are 4.00x6.00 inches. Board is double-sided with silkscreen that should be trimmed to board dimensions. | Both top and bottom layers contain a grounded copper pour. | Mounting holes should be 0.140" +/-.005". All other drills may be substituted within tolerances +0.005/-0.000" | Top layer | y=4.000" | x=6.000"
bDocu: Bottom Layer | y=4.000" | x=6.000"
_tsilk: 23B Shop Hacker Space | http://shop.23b.org | Open Access Control v2.11 | -/+ | 12VIN | 12V-A | 12V-B | 5V
_bsilk: 23B Shop Hacker Space | http://shop.23b.org | Experimental hardware - no | warranties expressed or implied.